# EAGLE design dcdc (EAGLE 9.5.2)
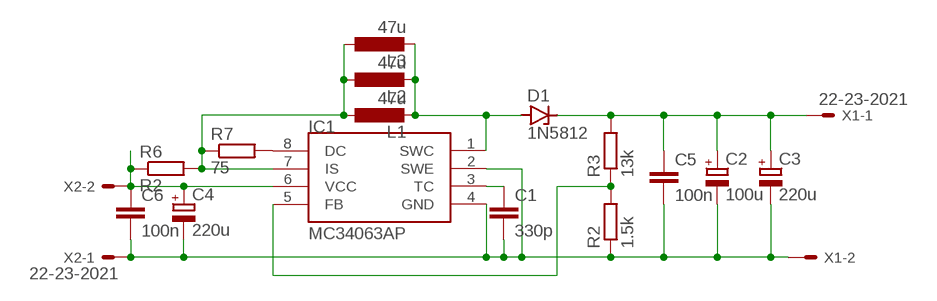
[diagram p0: schematic, sheet 1]

## Parts
C1  330p  C-EUC0805  [C0805]
C2  100u  CPOL-EUE5-8.5  [E5-8,5]
C3  220u  CPOL-EUE5-8.5  [E5-8,5]
C4  220u  CPOL-EUE5-8.5  [E5-8,5]
C5  100n  C-EUC0805  [C0805]
C6  100n  C-EUC0805  [C0805]
D1  1N5812  1N5333  [C1702-15]
IC1  MC34063AP  [DIL08]
L1  47u  L-EUTJ3-U2  [TJ3-U2]
L2  47u  L-EUTJ4-U2  [TJ4-U2]
L3  47u  L-EU6000-XXX-RC  [6000-XXXX-RC]
R2  1.5k  R-EU_R0805  [R0805]
R3  13k  R-EU_0204/7  [0204/7]
R6  R2  R-EU_R0805  [R0805]
R7  75  R-EU_R0805  [R0805]
X1  22-23-2021  [22-23-2021]
X2  22-23-2021  [22-23-2021]

## Nets
FB: IC1.5(FB) R2.2 R3.1
GND: C1.2 C2.- C3.- C4.- C5.2 C6.2 IC1.2(SWE) IC1.4(GND) R2.1 X1.2 X2.1
N$3: IC1.8(DC) R7.2
N$5: IC1.7(IS) L1.1 L2.1 L3.1 R6.2 R7.1
N$9: C1.1 IC1.3(TC)
SW: D1.A IC1.1(SWC) L1.2 L2.2 L3.2
VIN: C4.+ C6.1 IC1.6(VCC) R6.1 X2.2
VOUT: C2.+ C3.+ C5.1 D1.C R3.2 X1.1

## Library data of the parts
C1 C5 C6 = rcl:C-EU: CAPACITOR, European symbol; SPICEPREFIX: C
C2-C4 = rcl:CPOL-EU: POLARIZED CAPACITOR, European symbol; SPICEPREFIX: C
D1 = diode:1N5333: Z DIODE 3.3 V, 5W, 5 percent (Motorola)
IC1 = mc34063:MC34063
L1-L3 = rcl:L-EU: INDUCTOR, European symbol; SPICEPREFIX: L
R2 R3 R6 R7 = rcl:R-EU_: RESISTOR, European symbol; SPICEPREFIX: R
X1 X2 = con-molex:22-23-2021: .100" (2.54mm) Center Header - 2 Pin; MF: MOLEX; MPN: 22-23-2021; OC_FARNELL: 1462926; OC_NEWARK: 25C3832

## Board
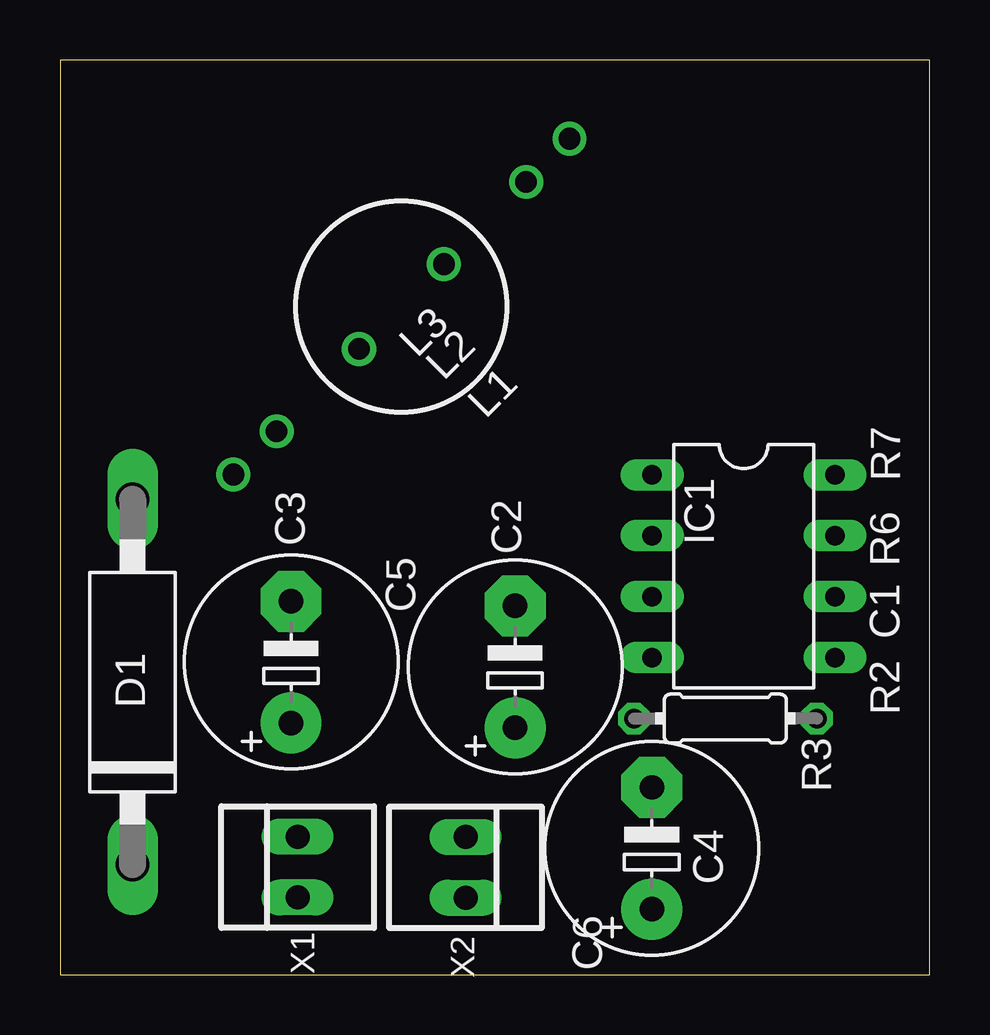
[diagram p1: board, top side]
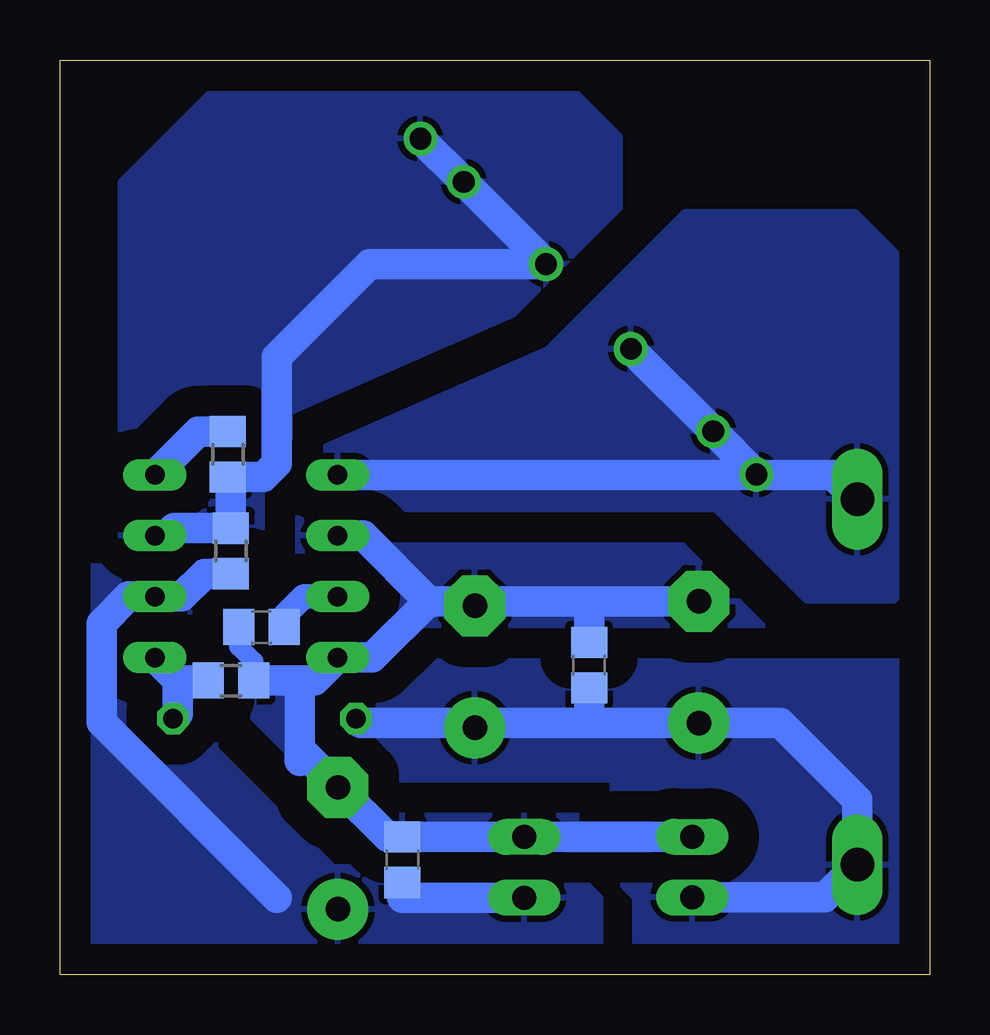
[diagram p2: board, bottom side, seen from below]

Size 36.24 x 38.13 mm. Coordinates in mm from the lower left corner, seen from the top.
Outline: 0,0 36.25,0 36.25,38.13 0,38.13 0,0
Copper layers (1*16): Top 0.035mm / dielectric 1.5mm / Bottom 0.035mm
Design rules "default": minimum track width 6mil, minimum drill 0.35mm, track to track 6mil, track to pad 6mil, pad to pad 6mil, via to via 6mil, smd to smd 6mil, copper to edge 40mil, drill to drill 6mil, minimum pad ring 10mil, minimum via ring 8mil, stop-mask expansion 4mil, vias tented up to drill 0mil, thermal gap 10mil

### Footprints (pad centres in the part's own frame; a part is rotated, then mirrored left to right if it is on the bottom)
C0805 = smd 1.3 x 1.5: 1 -0.95,0; 2 0.95,0
E5-8,5 = drill 1.016 pad 2.54: + -2.54,0 | drill 1.016 pad 2.54 octagon: - 2.54,0
C1702-15 = drill 1.397 long: A 7.62,0; C -7.62,0
DIL08 = drill 0.813 long: 1 -3.81,-3.81; 2 -1.27,-3.81; 3 1.27,-3.81; 4 3.81,-3.81; 5 3.81,3.81; 6 1.27,3.81; 7 -1.27,3.81; 8 -3.81,3.81
TJ3-U2 = drill 0.9: 1 -7.35,0; 2 7.35,0
TJ4-U2 = drill 0.9: 1 -9.9,0; 2 9.9,0
6000-XXXX-RC = drill 0.9 pad 1.422: 1 -2.5,0; 2 2.5,0
R0805 = smd 1.3 x 1.5: 1 -0.95,0; 2 0.95,0
0204/7 = drill 0.813 octagon: 1 -3.81,0; 2 3.81,0
22-23-2021 = drill 1 long: 1 -1.27,0; 2 1.27,0

### Placement (x,y rotation side)
C1  27.85,14.49 180 bottom
C2  18.96,12.84 90 top
C3  9.63,13.03 90 top
C4  24.66,5.27 90 top
C5  14.2,12.9 90 bottom
C6  21.98,4.79 90 bottom
D1  3.02,12.2 90 top
IC1  28.48,17.03 270 top
L1  14.22,27.85 225 top
L2  14.22,27.85 225 top
L3  14.22,27.85 225 top
R2  29.12,12.26 180 bottom
R3  27.72,10.68 180 top
R6  29.12,17.66 90 bottom
R7  29.25,21.69 90 bottom
X1  9.9,4.48 90 top
X2  16.9,4.47 270 top

### Tracks (layer width: path | path; a pad name or v marks a point on that pad's centre or on a via)
FB
  Bottom 1.27: R2.2 31.34,12.26 | 31.34,12.26 IC1.5 | R3.1 31.34,10.87 31.34,12.26
GND
  Bottom 0.813: R2.1 28.17,13.06 28.8,13.69 C1.2
  Bottom 1.27: 26.26,12.26 25.63,12.26 IC1.4 23.23,13.22 20.89,15.57 | 26.26,12.26 R2.1 | C3.- 14.19,15.57 | 14.19,15.57 18.77,15.57 | 18.77,15.57 C2.- | 20.89,15.57 18.77,15.57 | C5.2 14.2,15.56 14.19,15.57 | X1.2 X2.1 C6.2 22.6,5.74 C4.- 26.26,9.4 | 26.26,8.91 26.26,9.4 | 26.26,9.4 26.26,12.26 | IC1.2 23.62,18.3 20.89,15.57
  pour Bottom (isolate 1.27, rank 3): -0.1,0.03 35.94,0.03 35.94,37.82 -0.1,37.82
N$3
  Bottom 1.27: R7.2 30.49,22.64 IC1.8
N$5
  Bottom 1.27: IC1.7 31.81,18.3 31.49,18.61 R6.2 29.12,20.62 R7.1 27.77,20.74 27.21,21.31 27.21,25.75 23.34,29.62 L3.1 L1.1 L2.1
  pour Bottom (isolate 1.27, rank 2): 27.85,20.67 27.85,17.97 33.72,17.97 33.72,33.05 29.27,37.5 15.46,37.5 12.92,34.96 12.92,31.62 21.02,23.53 24.99,23.53
N$9
  Bottom 1.016: C1.1 26.9,14.95 26.09,15.76 IC1.3
SW
  Bottom 1.27: D1.A 4.04,20.84 7.21,20.84 | 7.21,20.84 IC1.1 | L3.2 L1.2 L2.2 7.21,20.84
  pour Bottom (isolate 1.27): 26.1,21.62 26.1,19.88 25.62,19.4 8.95,19.4 5.14,15.59 1.49,15.59 0.06,17.02 0.06,28.77 3.08,31.78 10.22,31.78 15.94,26.07 26.1,21.62
VIN
  Bottom 1.27: R6.1 30.22,16.71 31.17,15.76 IC1.6 33.4,15.76 34.51,14.64 34.51,10.51 27.21,3.2 | X2.2 21.98,3.2 C6.1
  pour Bottom (isolate 1.27, rank 2): 24.83,4.48 29.75,9.4 29.75,14.48 28.48,15.75 28.48,17.02 35.94,17.02 35.94,0.03 13.72,0.03 13.72,3.21 14.99,4.48
VOUT
  Bottom 1.27: 14.19,10.49 C3.+ 6.23,10.49 3.02,7.28 D1.C 4.39,3.21 X1.1 | 14.19,10.49 19.27,10.49 | 19.27,10.49 23.72,10.49 R3.2 | C2.+ 19.08,10.29 19.27,10.49 | C5.1 14.2,10.49 14.19,10.49
  pour Bottom (isolate 1.27, rank 2): 13.24,4.16 12.29,3.21 12.29,0.03 0.06,0.03 0.06,13.05 21.97,13.05 23.24,11.78 24.04,11.78 24.83,10.99 24.83,9.72 23.24,8.13 13.24,8.13